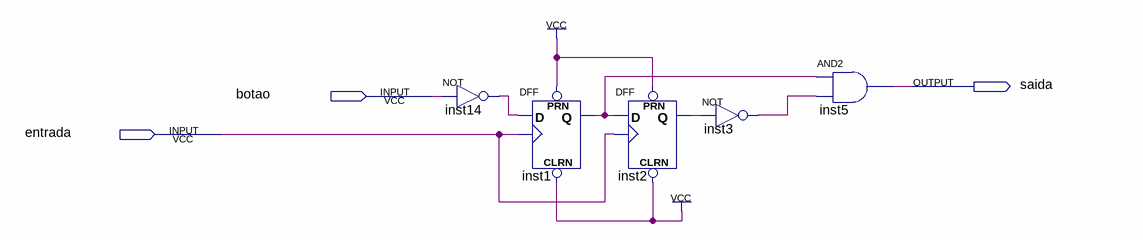
[diagram p0: schematic sheet]
// Quartus schematic debounce.bdf as structural Verilog: 5 symbols, 3 pins
module debounce (
  input  botao,
  input  entrada,
  output saida
);

  wire inst1_q, inst2_q, inst3_out, inst14_out;

  not inst14 (inst14_out, botao);
  DFF inst1 (.CLRN(1'b1), .CLK(entrada), .D(inst14_out), .PRN(1'b1), .Q(inst1_q));
  DFF inst2 (.CLRN(1'b1), .CLK(entrada), .D(inst1_q), .PRN(1'b1), .Q(inst2_q));
  not inst3 (inst3_out, inst2_q);
  and inst5 (saida, inst1_q, inst3_out);
endmodule
